# Altium project CANbus_SPI_Bridge.PrjPcb
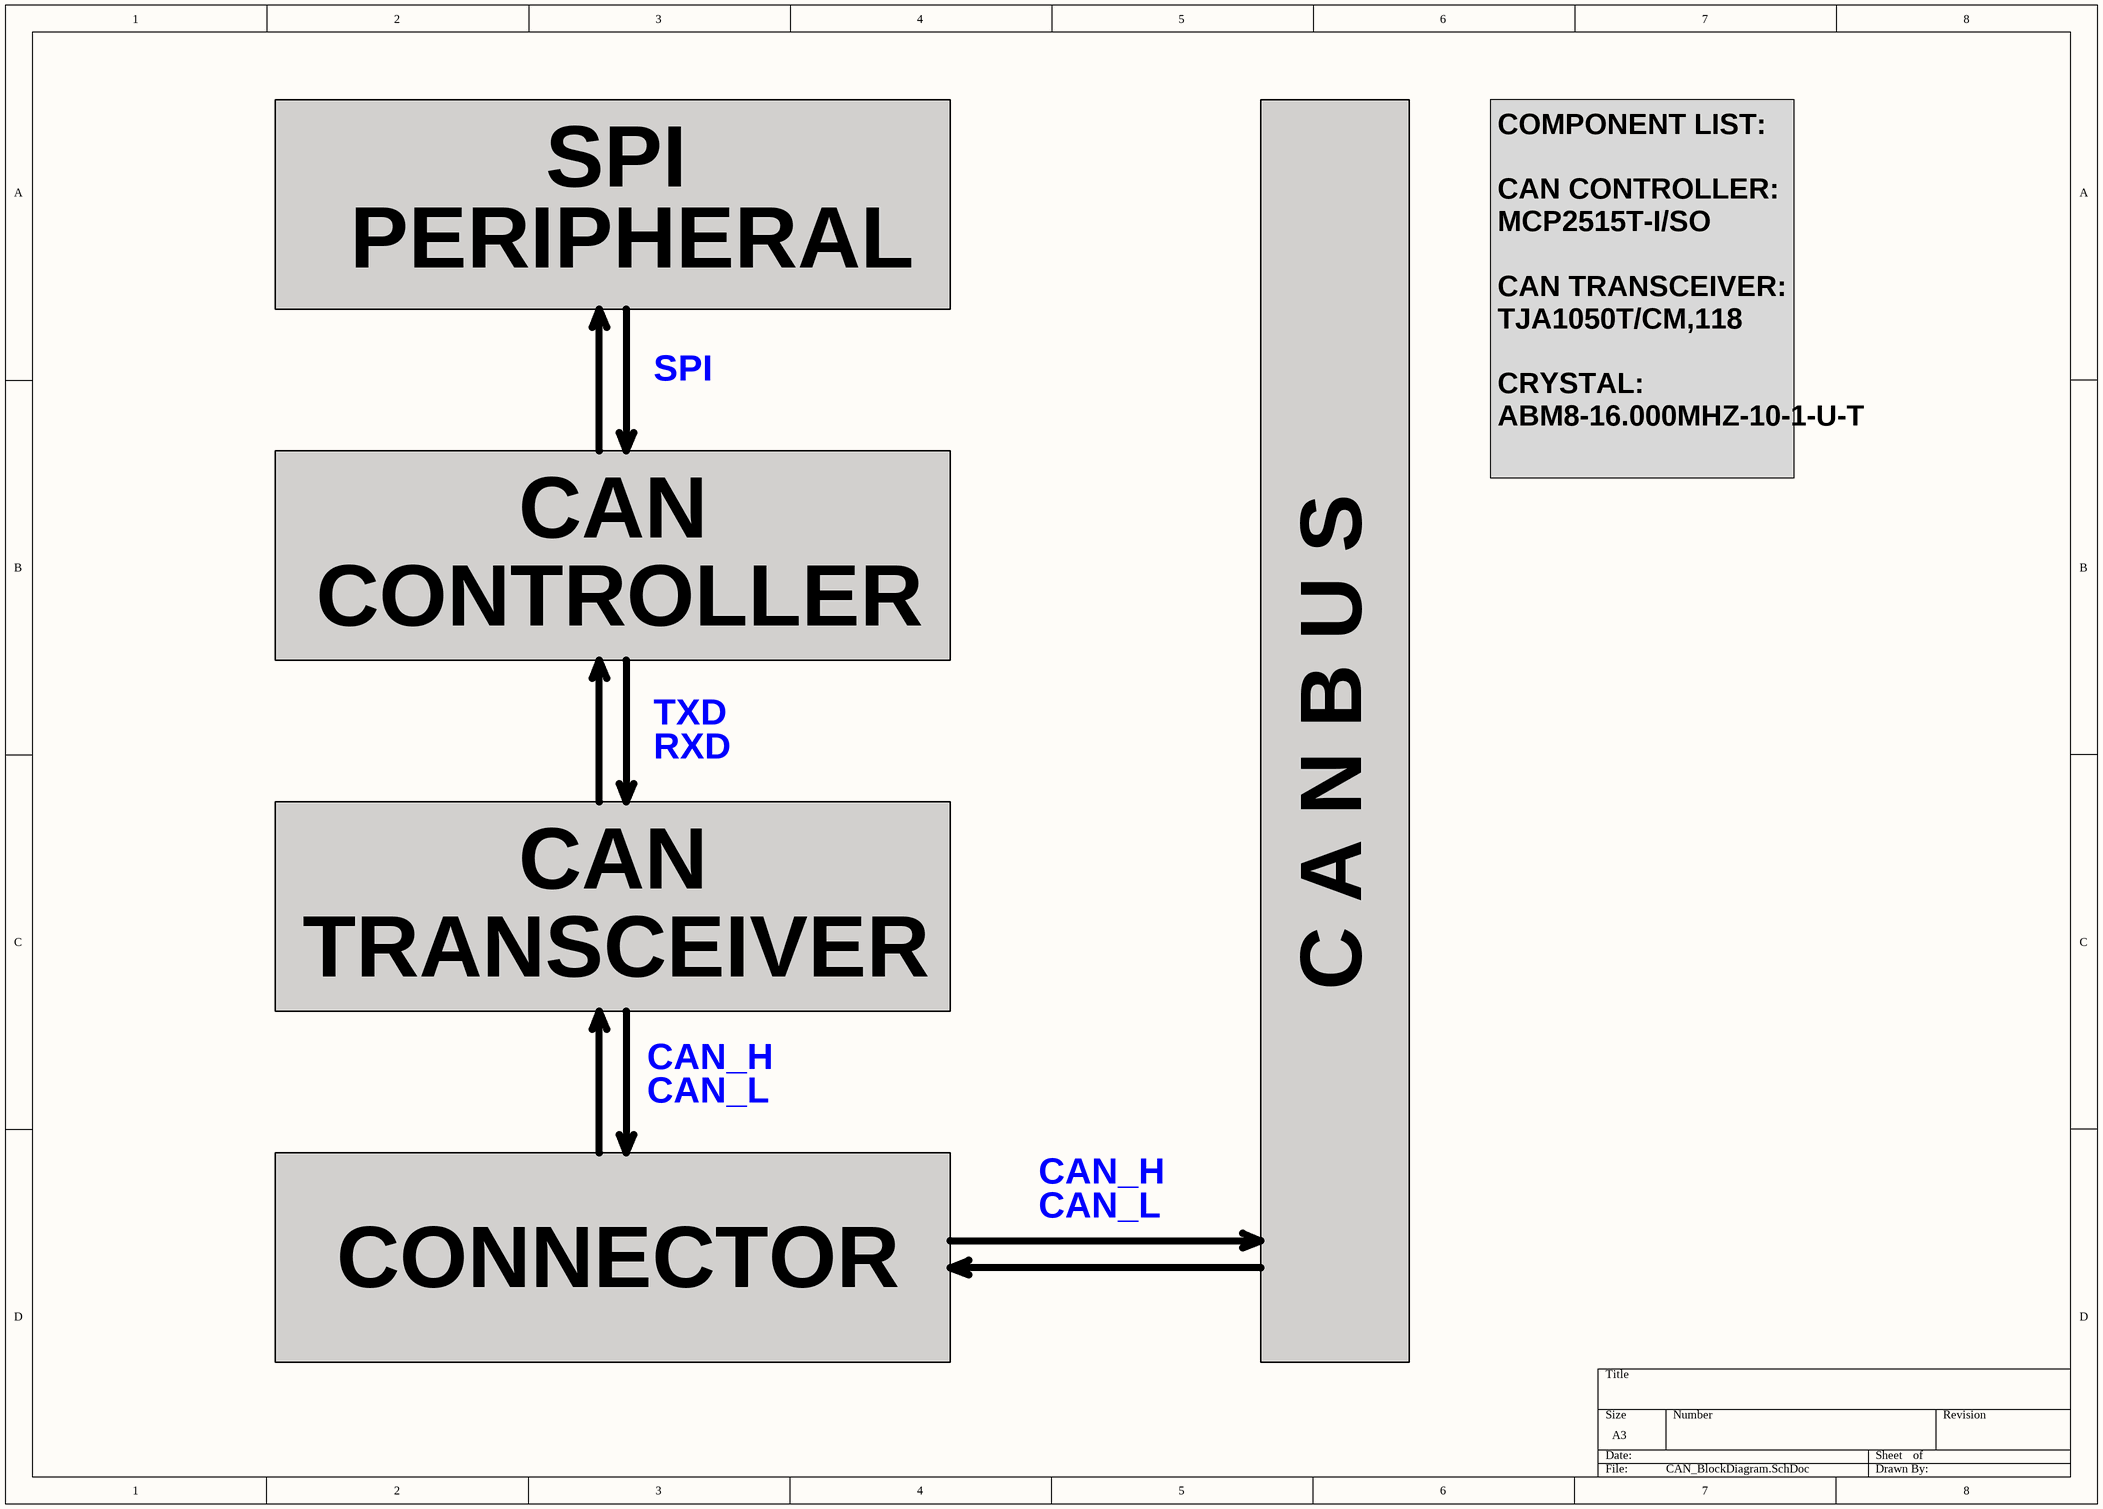
[diagram p0: CAN_BlockDiagram.SchDoc]
2 sheets, 17 parts. Net scope: flat (ports and power ports of the same name join across sheets).
Board file: CAN_PCB.PcbDoc
Sheets:
  CAN_BlockDiagram.SchDoc
  CAN_Schematic.SchDoc

## Sheet CAN_BlockDiagram.SchDoc
size A3; SheetNumber: 1; SheetTotal: 1

### Notes on the sheet
- SPI
- PERIPHERAL
- COMPONENT LIST:
  CAN CONTROLLER: MCP2515T-I/SO
  CAN TRANSCEIVER: TJA1050T/CM,118
  CRYSTAL: ABM8-16.000MHZ-10-1-U-T
- CAN
- CONTROLLER
- TXD
- RXD
- TRANSCEIVER
- C A N B U S
- CAN_H
- CAN_L
- CONNECTOR

## Sheet CAN_Schematic.SchDoc
size A3; SheetNumber: 2; SheetTotal: 2
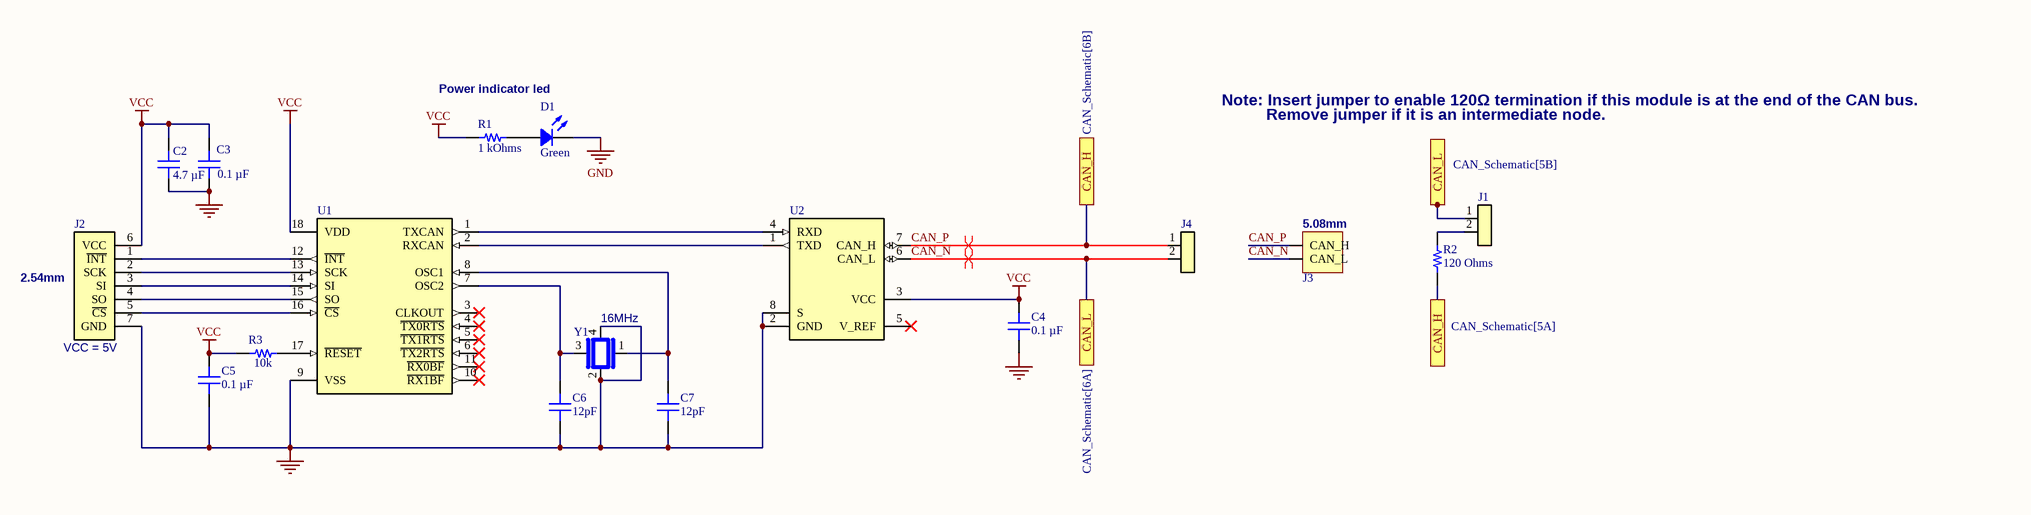
[diagram p1: CAN_Schematic.SchDoc]

### Parts
C2  4.7 µF  [CAP 0603_1608]
C3  0.1 µF  [CAP 0603_1608]
C4  0.1 µF  [CAP 0603_1608]
C5  0.1 µF  [CAP 0603_1608]
C6  12pF  [CAP 0603_1608]
C7  12pF  [CAP 0603_1608]
D1  Green  [LED 0603_1608 GREEN]
J1  PH1-02-UA  [CONN_PH1-02-UA_ADM]  (value not drawn)
J2  CONN HEADER VERT 7POS 2.54MM  [CONN_PH1-07-UA_ADM]  (value not drawn)
J3  282837-2  [TE 282837-2]  (value not drawn)
J4  PH1-02-UA  [CONN_PH1-02-UA_ADM]  (value not drawn)
R1  1 kOhms  [RES 0603_1608]
R2  120 Ohms  [RES 0603_1608]
R3  10k  [RES 0603_1608]
U1  CANbus Controller CAN 2.0 SPI Interface 18-SOIC  [SOIC18-1.27-11.5X7.5MM]  (value not drawn)
U2  1/1 Transceiver Half CANbus 8-SO  [SOIC8]  (value not drawn)
Y1  ABM8-16.000MHZ-10-1-U-T  [XTAL_ABM8-16.000MHZ-10-1-U-T]  (value not drawn)

### Ports
CAN_H (see CAN_Schematic[5A]), CAN_H (see CAN_Schematic[6B]), CAN_L (see CAN_Schematic[5B]), CAN_L (see CAN_Schematic[6A])

### Nets
GND: C2.1 C3.1 C4.1 C5.1 C6.1 C7.1 D1.2 J2.7(GND) U1.9(VSS) U2.2(GND) U2.8(S) Y1.2(GND) Y1.4(GND)
VCC: C2.2 C3.2 C4.2 C5.2 J2.6(VCC) R1.1 R3.1 U1.18(VDD) U2.3(VCC)
CAN_N: J1.1 J3.2(CAN_L) J4.2 U2.6(CAN_L) ; port CAN_L
CAN_P: J3.1(CAN_H) J4.1 R2.1 U2.7(CAN_H) ; port CAN_H
NetC6_2: C6.2 U1.7(OSC2) Y1.3
NetC7_2: C7.2 U1.8(OSC1) Y1.1
NetD1_1: D1.1 R1.2
NetJ1_2: J1.2 R2.2
NetJ2_1: J2.1(~{INT}) U1.12(~{INT})
NetJ2_2: J2.2(SCK) U1.13(SCK)
NetJ2_3: J2.3(SI) U1.14(SI)
NetJ2_4: J2.4(SO) U1.15(SO)
NetJ2_5: J2.5(~{CS}) U1.16(~{CS})
NetR3_2: R3.2 U1.17(~{RESET})
NetU1_1: U1.1(TXCAN) U2.4(RXD)
NetU1_2: U1.2(RXCAN) U2.1(TXD)

Not connected (* = marked no-connect by the designer): U1 3(CLKOUT)* 4(~{TX0RTS})* 5(~{TX1RTS})* 6(~{TX2RTS})* 10(~{RX1BF})* 11(~{RX0BF})*; U2 5(V_REF)*

### Layout directives
differential pair: CAN_N, CAN_P

### Notes on the sheet
- Power indicator led
- Note: Insert jumper to enable 120Ω termination if this module is at the end of the CAN bus.
- Remove jumper if it is an intermediate node.
- (near J3) 5.08mm
- 2.54mm
- (near Y1) 16MHz
- (near J2) VCC = 5V

### Library data of the parts
C2 = 0603YW475KAT2A: CAP CER 4.7UF 16V X6S 0603; manufacturer: KYOCERA AVX; Tolerance: ±10%; Part Number: 0603YW475KAT2A; Capacitance: 4.7 µF; Applications: General Purpose; componentlink1description: Datasheet; componentlink1url: https://catalogs.kyocera-avx.com/SurfaceMount.pdf; componentlink2description: DigiKey Link; componentlink2url: https://www.digikey.com/en/products/detail/kyocera-avx/0603YW475KAT2A/14112130; Device Package: 0603 (1608 Metric); lastupdated: 6.04.2026 19:22:31; Lifecycle Status: Active; Minimum Order: 1; Mounting Type: Surface Mount, MLCC; Operating Temperature: -55°C ~ 105°C; Package / Case: 0603 (1608 Metric); packaging: TapeAndReel; partid: 35833; Part Status: Active; price: 0.07; series: -; Size / Dimension: 0.063" L x 0.031" W (1.60mm x 0.80mm); Supplier 1: DigiKey; Supplier Part Number 1: 478-0603YW475KAT2ACT-ND; Temperature Coefficient: X6S; Thickness (Max): 0.039" (1.00mm); value: 4.7 µF; Voltage - Rated: 16V
C3-C5 = CL10E104KC8VPNC: CAP CER 100NF 100V X8L 0603; manufacturer: Samsung Electro-Mechanics; Tolerance: ±10%; Part Number: CL10E104KC8VPNC; Capacitance: 0.1 µF; Applications: Automotive; componentlink1description: Datasheet; componentlink1url: https://mm.digikey.com/Volume0/opasdata/d220001/medias/docus/5458/CL10E104KC8VPNC_Spec.pdf; componentlink2description: DigiKey Link; componentlink2url: https://www.digikey.com/en/products/detail/samsung-electro-mechanics/CL10E104KC8VPNC/20498486; Device Package: 0603 (1608 Metric); Features: General Purpose; lastupdated: 6.04.2026 19:18:46; Lifecycle Status: Active; Minimum Order: 1; Mounting Type: Surface Mount, MLCC, Epoxy; Operating Temperature: -55°C ~ 150°C; Package / Case: 0603 (1608 Metric); packaging: TapeAndReel; partid: 68845; price: 0.04; Ratings: AEC-Q200; series: CL; Size / Dimension: 0.063" L x 0.031" W (1.60mm x 0.80mm); Supplier 1: DigiKey; Supplier Part Number 1: 1276-CL10E104KC8VPNCCT-ND; Temperature Coefficient: X8L; Thickness (Max): 0.035" (0.88mm); value: 0.1 µF; Voltage - Rated: 100V
C6 C7 = 0603YA120KAT2A: CAP CER 12PF 16V C0G/NP0 0603; manufacturer: AVX Corporation; Temperature Coefficient: C0G, NP0; Tolerance: ±10%; Part Number: 0603YA120KAT2A; Capacitance: 12pF; Applications: General Purpose; componentlink1description: Datasheet; componentlink1url: http://datasheets.avx.com/C0GNP0-Dielectric.pdf; componentlink2description: DigiKey Link; componentlink2url: http://digikey.com/product-detail/en/avx-corporation/0603YA120KAT2A/478-11444-1-ND/8019299; Device Package: 0603 (1608 Metric); lastupdated: 2.09.2020 01:03:12; Lifecycle Status: Active; Minimum Order: 1; Mounting Type: Surface Mount, MLCC; Operating Temperature: -55°C ~ 125°C; Package / Case: 0603 (1608 Metric); packaging: TapeAndReel; partid: 14609; Part Status: Active; price: 0.04; series: -; Size / Dimension: 0.063" L x 0.032" W (1.60mm x 0.81mm); Supplier 1: DigiKey; Supplier Part Number 1: 478-11444-1-ND; Thickness (Max): 0.035" (0.90mm); value: 12pF; Voltage - Rated: 16V
D1 = 5973316507F: LED GREEN 0603 SMD; Manufacturer: Dialight; Configuration: Standard; Current - Test: 20mA; Lens Color: 1.24mm; Lens Style: Round with Domed Top; Millicandela Rating: 34mcd; Voltage - Forward (Vf) (Typ): 2V; Wavelength - Dominant: 560nm; Part Number: 5973316507F; Color: Green; ComponentLink1Description: Datasheet; ComponentLink1URL: http://www.dialightsignalsandcomponents.com/Assets/Drawings/2D_Drawings_DrawingDetailedSpec/NewDrawings/C18371C.pdf; ComponentLink2Description: DigiKey Link; ComponentLink2URL: https://www.digikey.com/en/products/detail/dialight/5973316507F/9385428; Device Package: 0603 (1608 Metric); Height (Max): 1.24mm; LastUpdated: 5.04.2026 20:36:38; Lifecycle Status: Active; Minimum Order: 1; Mounting Type: Surface Mount; Package / Case: 0603 (1608 Metric); Packaging: TapeAndReel; PartId: 587; Part Status: Active; Price: 0.14; Series: 597; Size / Dimension: 1.60mm L x 0.80mm W; Supplier 1: DigiKey; Supplier Part Number 1: 350-4373-1-ND; Supplier Device Package: 0603; Value: Green
J1 J4 = PH1-02-UA: No Description Available; Manufacturer_Name: ADAM TECHNOLOGIES INC; Type: Headers, Male Pins; Copyright: Copyright (C) 2026 Ultra Librarian. All rights reserved.; Manufacturer_Part_Number: PH1-02-UA; Digi-Key_Part_Number_1: 2057-PH1-02-UA-ND; RefDes: RefDes
J2 = PH1-07-UA: Manufacturer_Name: ADAM TECHNOLOGIES INC; Type: Headers, Male Pins; Copyright: Copyright (C) 2026 Ultra Librarian. All rights reserved.; Manufacturer_Part_Number: PH1-07-UA; Digi-Key_Part_Number_1: 2057-PH1-07-UA-ND; RefDes: RefDes
J3 = 282837-2: TERM BLK 2P SIDE ENT 5.08MM PCB; Manufacturer: TE Connectivity AMP Connectors; Current: 13.5 A; Mating Orientation: Horizontal with Board; Number of Levels: 1; Pitch: 0.200" (5.08mm); Positions Per Level: 2; Voltage: 300 V; Wire Gauge: 16-28 AWG; Wire Termination: Screw - Rising Cage Clamp; Part Number: 282837-2; Color: Green; ComponentLink1Description: Datasheet; ComponentLink1URL: https://www.te.com/commerce/DocumentDelivery/DDEController?Action=srchrtrv&DocNm=282837&DocType=Customer+Drawing&DocLang=English; ComponentLink2Description: DigiKey Link; ComponentLink2URL: https://www.digikey.com/en/products/detail/te-connectivity-amp-connectors/282837-2/2187973; Features: Interlocking (Side); LastUpdated: 21.06.2022 15:00:23; Lifecycle Status: Active; Minimum Order: 1; Mounting Type: Through Hole; Packaging: Tray; Part Status: Active; Price: 0.31; Series: Buchanan; Supplier 1: DigiKey; Supplier Part Number 1: A113320-ND
R1 = TNPU06031K00AYEA00: RES 1 KOHM 0.05% 1/10W 0603; Manufacturer: Vishay Dale; Power (Watts): 0.1W, 1/10W; Temperature Coefficient: ±10ppm/°C; Part Number: TNPU06031K00AYEA00; Value: 1 kOhms; ComponentLink1Description: Datasheet; ComponentLink1URL: http://www.vishay.com/docs/28779/tnpue3.pdf; ComponentLink2Description: DigiKey Link; ComponentLink2URL: https://www.digikey.com/en/products/detail/vishay-dale/TNPU06031K00AYEA00/9448841; Composition: Thin Film; Device Package: 0603 (1608 Metric); Features: Anti-Sulfur, Automotive AEC-Q200, Moisture Resistant; Height - Seated (Max): 0.022" (0.55mm); LastUpdated: 9.02.2024 20:43:29; Lifecycle Status: Active; Minimum Order: 1; Number of Terminations: 2; Operating Temperature: -55°C ~ 125°C; Package / Case: 0603 (1608 Metric); Packaging: TapeAndReel; PartId: 6824; Part Status: Active; Price: 0.70; Ratings: AEC-Q200; Resistance: 1 kOhms; Series: TNPU e3; Size / Dimension: 0.063" L x 0.033" W (1.60mm x 0.85mm); Supplier 1: DigiKey; Supplier Part Number 1: 541-4648-1-ND; Supplier Device Package: 0603; Tolerance: ±0.05%
R2 = TNPU0603120RAYEN00: RES 120 OHM 0.05% 1/10W 0603; Manufacturer: Vishay Dale; Power (Watts): 0.1W, 1/10W; Temperature Coefficient: ±10ppm/°C; Part Number: TNPU0603120RAYEN00; Value: 120 Ohms; ComponentLink1Description: Datasheet; ComponentLink1URL: http://www.vishay.com/docs/28779/tnpue3.pdf; ComponentLink2Description: DigiKey Link; ComponentLink2URL: https://www.digikey.com/en/products/detail/vishay-dale/TNPU0603120RAYEN00/9448838; Composition: Thin Film; Device Package: 0603 (1608 Metric); Features: Anti-Sulfur, Automotive AEC-Q200, Moisture Resistant; Height - Seated (Max): 0.022" (0.55mm); LastUpdated: 9.02.2024 20:43:28; Lifecycle Status: Active; Minimum Order: 1; Number of Terminations: 2; Operating Temperature: -55°C ~ 125°C; Package / Case: 0603 (1608 Metric); Packaging: TapeAndReel; PartId: 7153; Part Status: Active; Price: 0.86; Ratings: AEC-Q200; Resistance: 120 Ohms; Series: TNPU e3; Size / Dimension: 0.063" L x 0.033" W (1.60mm x 0.85mm); Supplier 1: DigiKey; Supplier Part Number 1: 541-4645-1-ND; Supplier Device Package: 0603; Tolerance: ±0.05%
R3 = TNPW060310K0FHTA: RES 10K OHM 1% 1/10W 0603; Manufacturer: Vishay Dale; Power (Watts): 0.1W, 1/10W; Resistance: 10 kOhms; Temperature Coefficient: ±50ppm/°C; Part Number: TNPW060310K0FHTA; Value: 10k; ComponentLink2Description: DigiKey Link; ComponentLink2URL: https://www.digikey.com/en/products/detail/vishay-dale/TNPW060310K0FHTA/7354881; Composition: Thin Film; Device Package: 0603 (1608 Metric); Features: Military; Height - Seated (Max): 0.022" (0.55mm); LastUpdated: 9.02.2024 20:43:19; Lifecycle Status: Active; Minimum Order: 1; Number of Terminations: 2; Operating Temperature: -55°C ~ 125°C; Package / Case: 0603 (1608 Metric); Packaging: TapeAndReel; PartId: 9361; Part Status: Active; Price: 0.09; Series: TNPW; Size / Dimension: 0.063" L x 0.033" W (1.60mm x 0.85mm); Supplier 1: DigiKey; Supplier Part Number 1: 541-3906-1-ND; Supplier Device Package: 0603; Tolerance: ±1%
U1 = MCP2515T-I/SO: CAN controller w/ SPI interface18 SOIC .300in T/R | Microchip Technology Inc. MCP2515T-I/SO; SnapEDA_Link: https://www.snapeda.com/parts/MCP2515T-I/SO/Microchip/view-part/?ref=snap; Package: SOIC-18 Microchip; Value: *; MF: Microchip; MP: MCP2515T-I/SO; Check_prices: https://www.snapeda.com/parts/MCP2515T-I/SO/Microchip/view-part/?ref=eda
U2 = TJA1050T/CM,118: TJA1050T Series 5.25 V 1 MBd Surface Mount High Speed CAN Transceiver - SOIC-8; Manufacturer: NXP Semiconductors; Data Rate: 1Mbps; Max Junction Temperature (Tj): 150°C; Max Supply Current: 75µA; Max Supply Voltage: 5.25V; Min Supply Voltage: 4.75V; Nominal Supply Current: 10mA; Nominal Supply Voltage (DC): 5V; Number of Circuits: 1; Receiver Hysteresis: 70mV; Simplex/Duplex: Half Duplex; Supplier 1: Future Electronics; Manufacturer Part Number: TJA1050T/CM,118; RoHS: Compliant; Category: CAN Transceivers; Stock 1: 130000; Pricing 1: 2500=0,93, 5000=0,92, 7500=0,905 (USD); Case/Package: SOP; China RoHS: Compliant; Contact Plating: Gold, Silver; Country of Origin: Thailand; Export Control Classification Number (ECCN) Code: EAR99; Height: 1.75mm; Height - Seated (Max): 1.75mm; Harmonized Tariff Schedule (HTS) Code: 8542.39.00.01; Interface: CAN; Introduction Date: 2003-10-24; Lead Free: Lead Free; Length: 4.9mm; Lifecycle Status: NRND; Max Operating Temperature: 125°C; Min Operating Temperature: -40°C; Mounting Technology: Surface Mount; Pins: 8; Number of Receive Buffers: 1; Number of Terminals: 8; Number of Transceivers: 1; Number of Transmit Buffers: 1; Radiation Hardening: No; REACH SVHC: Yes; Schedule B: 8542390000, 8542390000|8542390000|8542390000|8542390000|8542390000; Temperature Grade: Automotive; Terminal Pitch: 1.27mm; Width: 3.9mm; ComponentLink1URL: https://datasheet.octopart.com:443/TJA1050T-CM%2C118-NXP-Semiconductors-datasheet-48387.pdf?src-supplier=LCSC; ComponentLink1Description: https://datasheet.octopart.com:443/TJA1050T-CM%2C118-NXP-Semiconductors-datasheet-48387.pdf?src-supplier=LCSC; ComponentLink2URL: https://sigma.octopart.com:443/138890721/technical_drawing/NXP-Semiconductors-TJA1050T-CM%2C118.pdf?src-supplier=Upverter; ComponentLink2Description: https://sigma.octopart.com:443/138890721/technical_drawing/NXP-Semiconductors-TJA1050T-CM%2C118.pdf?src-supplier=Upverter; ComponentLink3URL: https://datasheet.octopart.com:443/TJA1050T-CM%2C118-NXP-Semiconductors-datasheet-180936223.pdf?src-supplier=IHS; ComponentLink3Description: https://datasheet.octopart.com:443/TJA1050T-CM%2C118-NXP-Semiconductors-datasheet-180936223.pdf?src-supplier=IHS; ComponentLink4URL: http://sigma.octopart.com:80/reach_statement/NXP-Semiconductors-company-13.pdf?src-supplier=Compliance+Statements; ComponentLink4Description: http://sigma.octopart.com:80/reach_statement/NXP-Semiconductors-company-13.pdf?src-supplier=Compliance+Statements; ComponentLink5URL: http://sigma.octopart.com:80/rohs_statement/NXP-Semiconductors-company-12.pdf?src-supplier=Compliance+Statements; ComponentLink5Description: http://sigma.octopart.com:80/rohs_statement/NXP-Semiconductors-company-12.pdf?src-supplier=Compliance+Statements; Supplier Part Number 1: TJA1050T/CM,118
Y1 = ABM8-16.000MHZ-10-1-U-T: 16 MHz Â±10ppm Crystal 10pF 70 Ohms 4-SMD, No Lead; MF: Abracon; SnapEDA_Link: https://www.snapeda.com/parts/ABM8-16.000MHZ-10-1-U-T/Abracon/view-part/?ref=snap; Package: NON-STANDARD-4 ABRACON; Value: *; MP: ABM8-16.000MHZ-10-1-U-T; Check_prices: https://www.snapeda.com/parts/ABM8-16.000MHZ-10-1-U-T/Abracon/view-part/?ref=eda